# EAGLE design ball_catch_order (EAGLE 9.6.2)
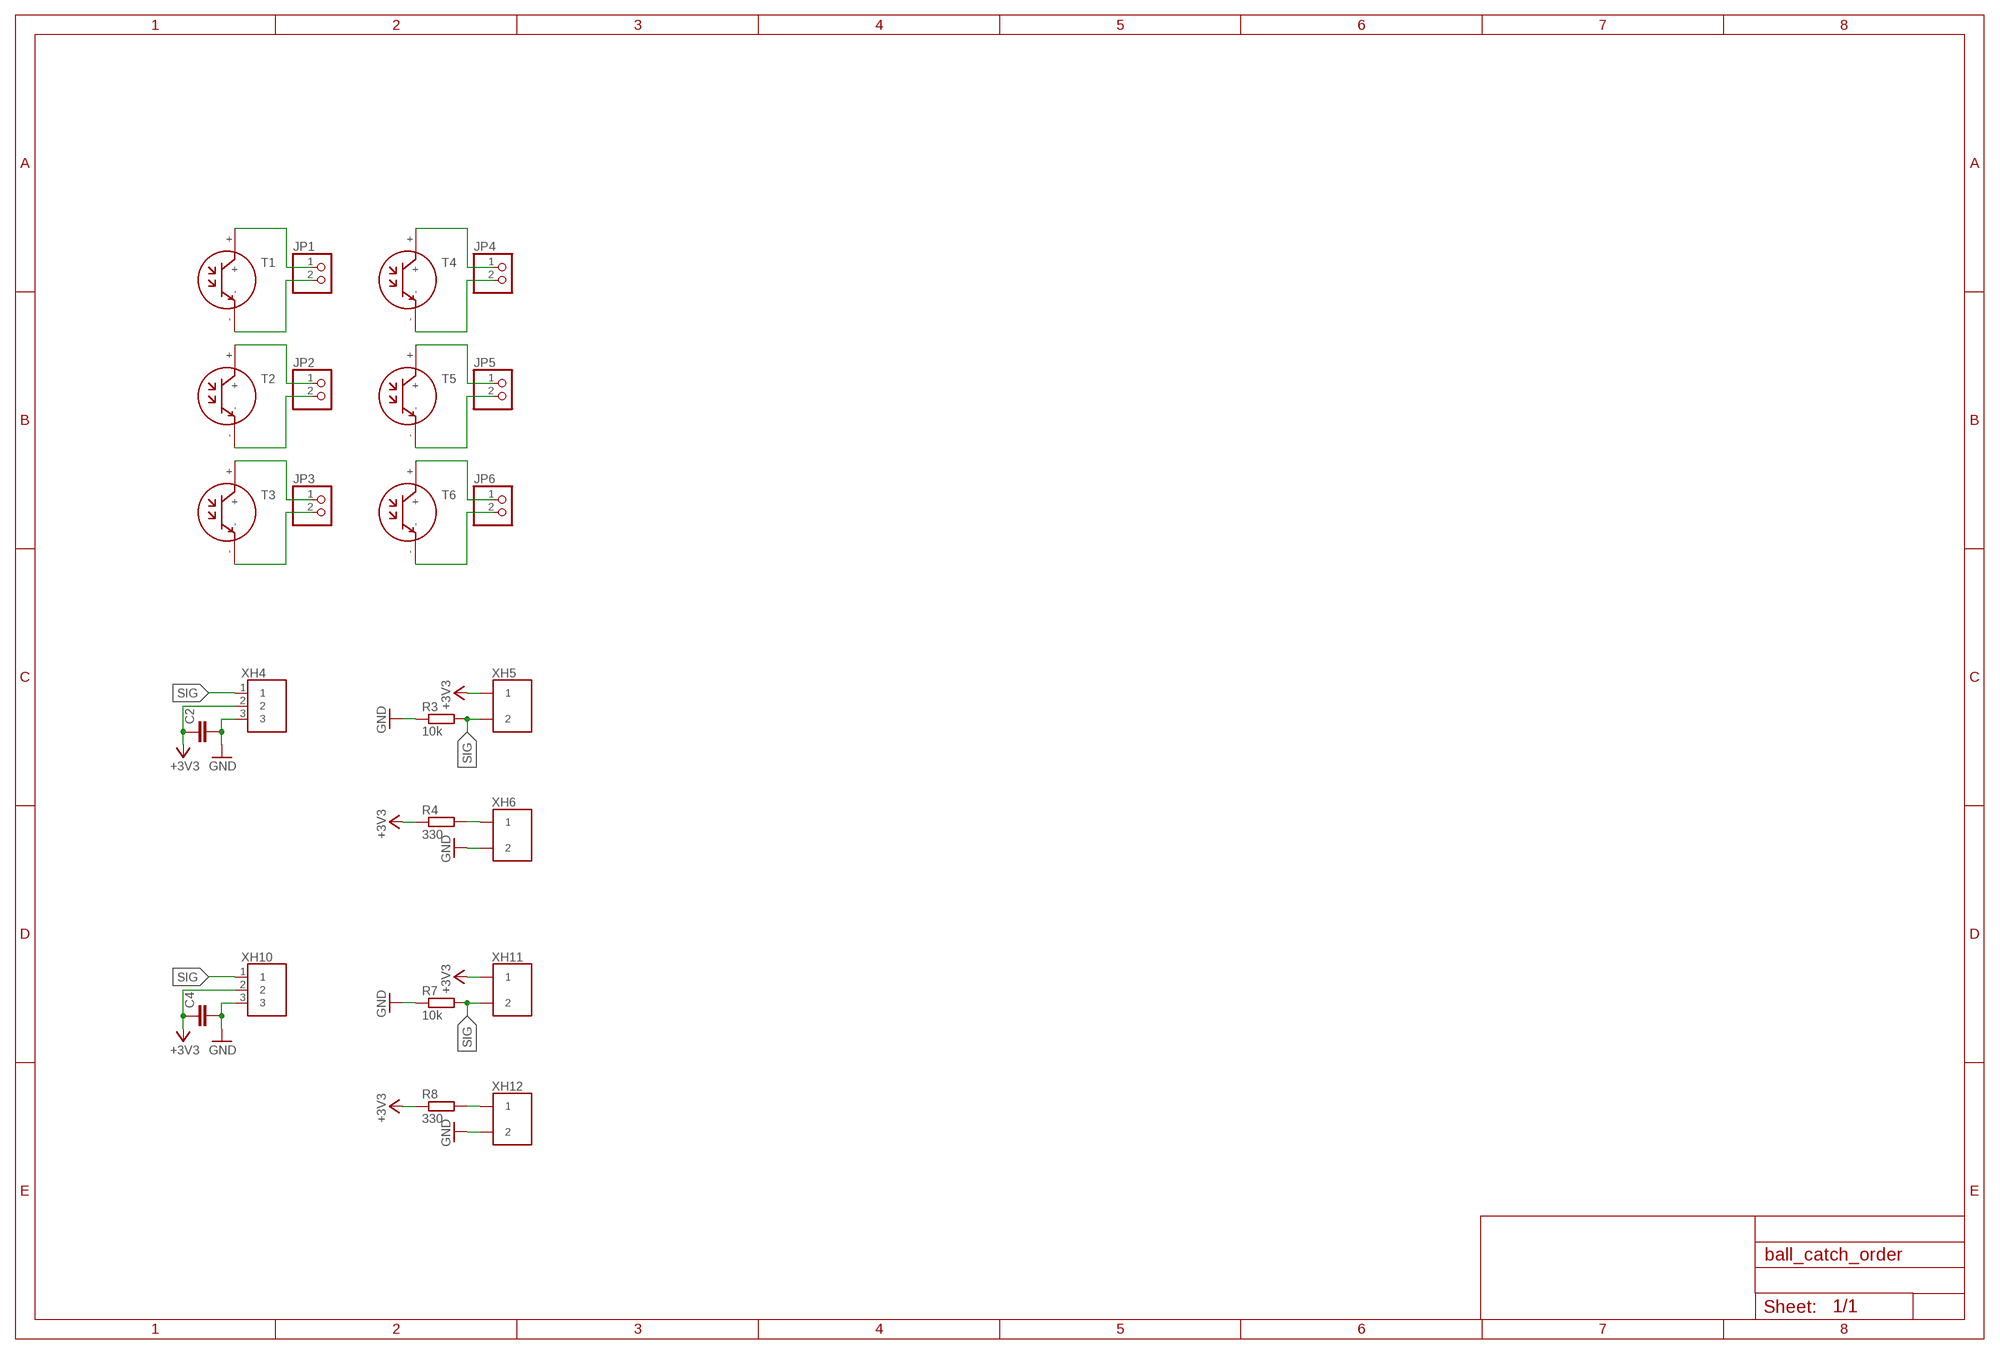
[diagram p0: schematic, sheet 1]

## Parts
C2  C-EUC0603  [C0603]
C4  C-EUC0603  [C0603]
JP1  PINHD-1X2  [1X02]
JP2  PINHD-1X2  [1X02]
JP3  PINHD-1X2  [1X02]
JP4  PINHD-1X2  [1X02]
JP5  PINHD-1X2  [1X02]
JP6  PINHD-1X2  [1X02]
R3  10k  R-EU_0204/7  [0204/7]
R4  330  R-EU_0204/7  [0204/7]
R7  10k  R-EU_0204/7  [0204/7]
R8  330  R-EU_0204/7  [0204/7]
T1  NJL7302L-F3  [NJL7302L-F3]
T2  NJL7302L-F3  [NJL7302L-F3]
T3  NJL7302L-F3  [NJL7302L-F3]
T4  NJL7302L-F3  [NJL7302L-F3]
T5  NJL7302L-F3  [NJL7302L-F3]
T6  NJL7302L-F3  [NJL7302L-F3]
XH4  S3B  [S3B]
XH5  2B  [2B]
XH6  S2B  [S2B]
XH10  S3B  [S3B]
XH11  2B  [2B]
XH12  S2B  [S2B]

## Nets
+3V3: C2.1 C4.1 R4.1 R8.1 XH4.2 XH5.1 XH10.2 XH11.1
GND: C2.2 C4.2 R3.1 R7.1 XH4.3 XH6.2 XH10.3 XH12.2
N$1: JP1.1 T1.+
N$2: JP1.2 T1.-
N$3: JP2.1 T2.+
N$4: JP2.2 T2.-
N$5: JP3.1 T3.+
N$6: JP3.2 T3.-
N$7: JP4.1 T4.+
N$8: JP4.2 T4.-
N$9: JP5.1 T5.+
N$10: JP5.2 T5.-
N$11: JP6.1 T6.+
N$12: JP6.2 T6.-
N$14: R4.2 XH6.1
N$16: R8.2 XH12.1
SIG: R3.2 R7.2 XH4.1 XH5.2 XH10.1 XH11.2

## Library data of the parts
C2 C4 = rcl:C-EU: CAPACITOR, European symbol; SPICEPREFIX: C
JP1-JP6 = pinhead:PINHD-1X2: PIN HEADER
R3 R4 R7 R8 = rcl:R-EU_: RESISTOR, European symbol; SPICEPREFIX: R
T1-T6 = NJL7302L-F3:NJL7302L-F3
XH4 XH10 = XH:S3B
XH5 XH11 = XH:2B
XH6 XH12 = XH:S2B

## Board
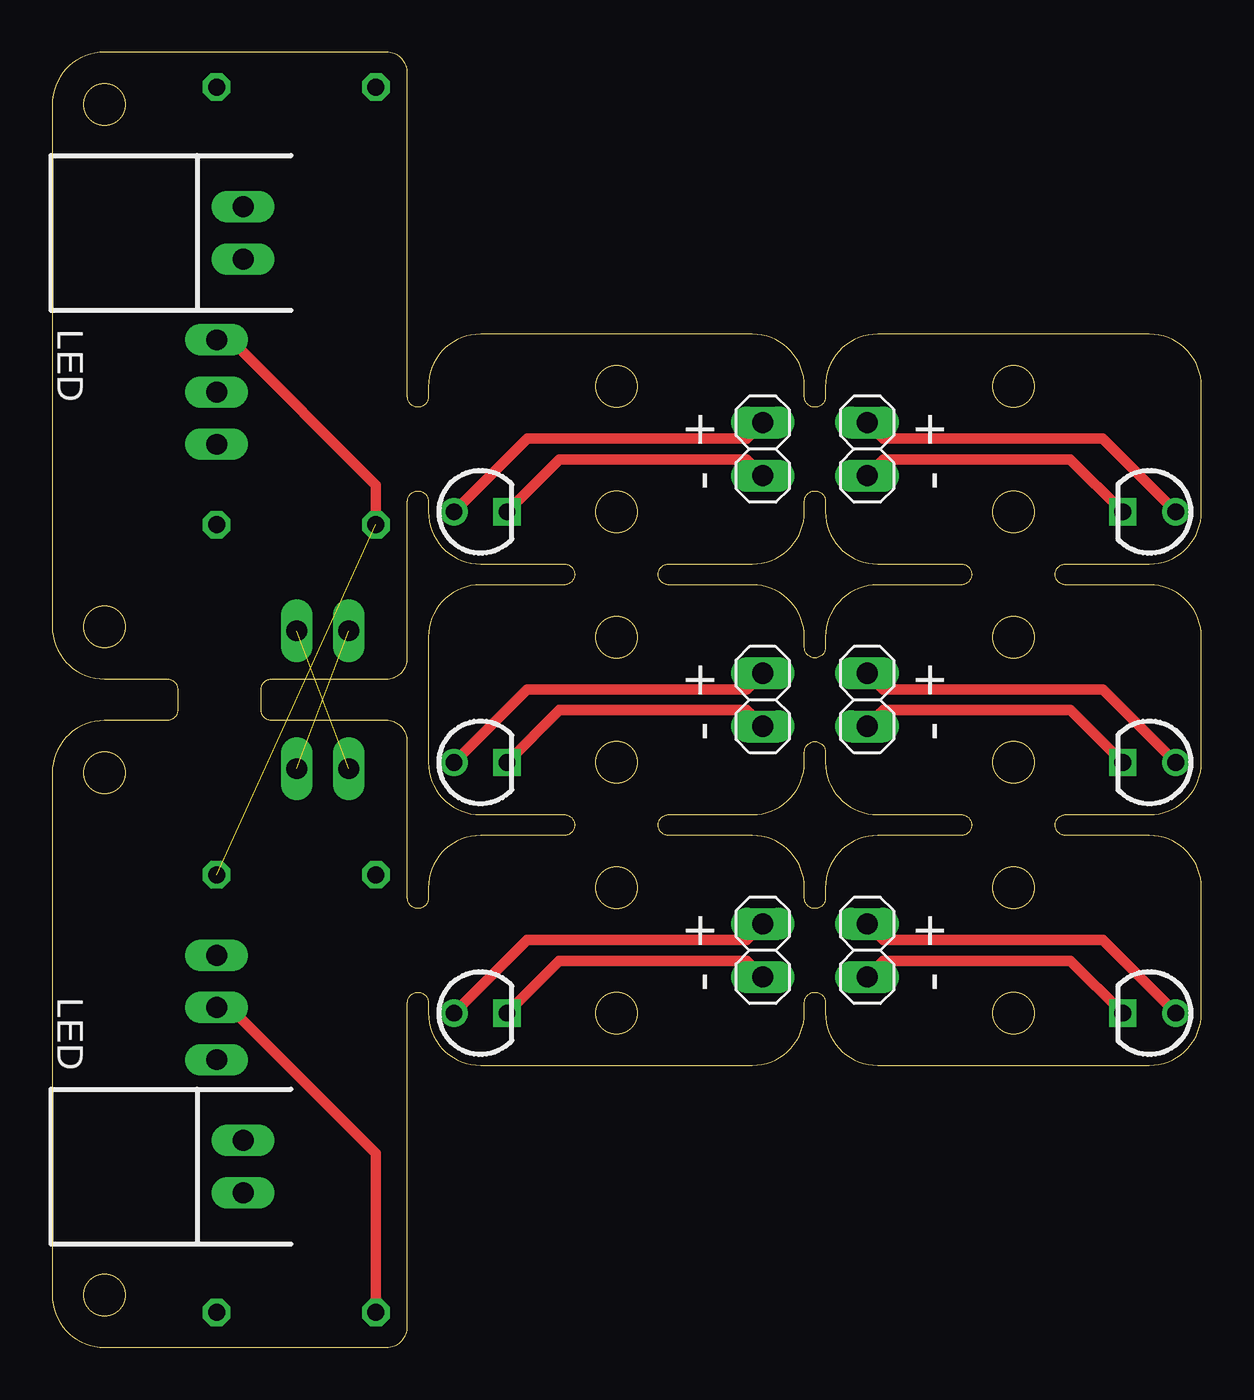
[diagram p1: board, top side]
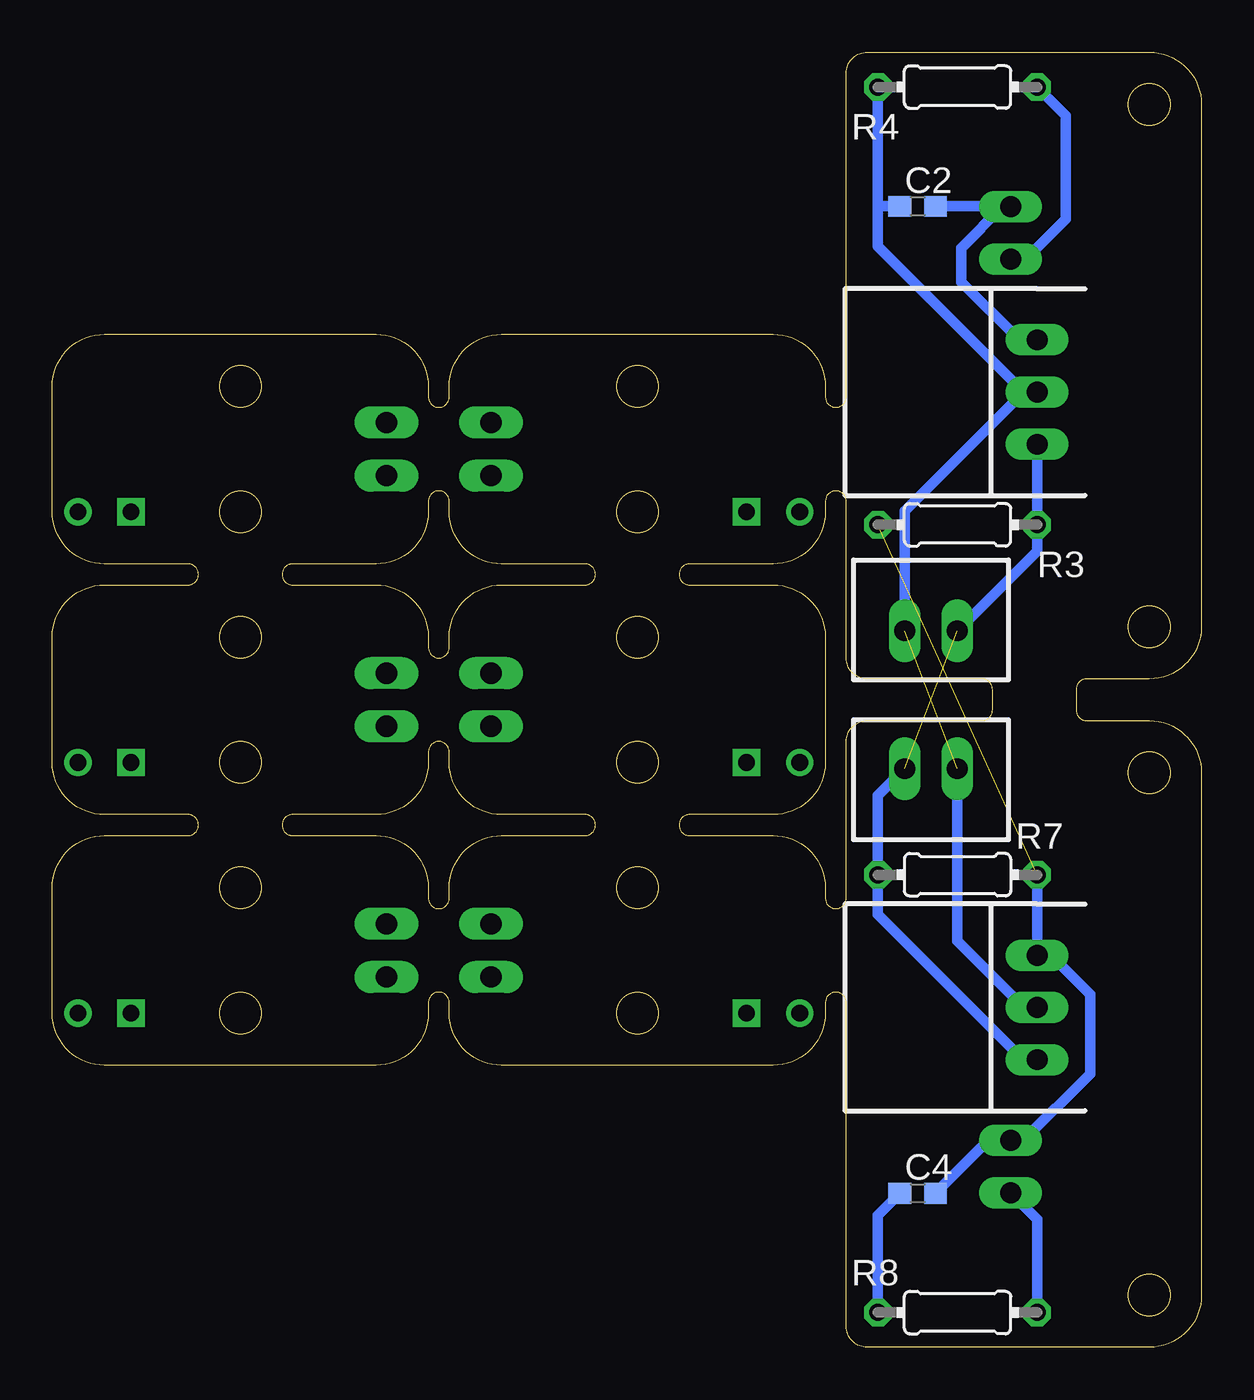
[diagram p2: board, bottom side, seen from below]

Size 55 x 62 mm. Coordinates in mm from the lower left corner, seen from the top.
Outline: 16,32 arc90 17,33 17,40.5 arc-90 17.5,41 arc-90 18,40.5 18,40 arc90 20.5,37.5 24.5,37.5 arc-180 24.5,36.5 20.5,36.5 arc90 18,34 18,28 arc90 20.5,25.5 24.5,25.5 arc-180 24.5,24.5 20.5,24.5 arc90 18,22 18,21.5 arc-90 17.5,21 arc-90 17,21.5 17,29 arc90 16,30 10.5,30 arc-90 10,30.5 10,31.5 arc-90 10.5,32 16,32
Outline: 17,61 arc90 16,62 2.5,62 arc90 0,59.5 0,34.5 arc90 2.5,32 5.5,32 arc-90 6,31.5 6,30.5 arc-90 5.5,30 2.5,30 arc90 0,27.5 0,2.5 arc90 2.5,0 16,0 arc90 17,1 17,16.5 arc-90 17.5,17 arc-90 18,16.5 18,16 arc90 20.5,13.5 33.5,13.5 arc90 36,16 36,16.5 arc-180 37,16.5 37,16 arc90 39.5,13.5 52.5,13.5 arc90 55,16 55,22 arc90 52.5,24.5 48.5,24.5 arc-180 48.5,25.5 52.5,25.5 arc90 55,28 55,34 arc90 52.5,36.5 48.5,36.5 arc-180 48.5,37.5 52.5,37.5 arc90 55,40 55,46 arc90 52.5,48.5 39.5,48.5 arc90 37,46 37,45.5 arc-180 36,45.5 36,46 arc90 33.5,48.5 20.5,48.5 arc90 18,46 18,45.5 arc-90 17.5,45 arc-90 17,45.5 17,61
Outline: 37,28.5 37,28 arc90 39.5,25.5 43.5,25.5 arc-180 43.5,24.5 39.5,24.5 arc90 37,22 37,21.5 arc-180 36,21.5 36,22 arc90 33.5,24.5 29.5,24.5 arc-180 29.5,25.5 33.5,25.5 arc90 36,28 36,28.5 arc-180 37,28.5
Outline: 37,40.5 37,40 arc90 39.5,37.5 43.5,37.5 arc-180 43.5,36.5 39.5,36.5 arc90 37,34 37,33.5 arc-180 36,33.5 36,34 arc90 33.5,36.5 29.5,36.5 arc-180 29.5,37.5 33.5,37.5 arc90 36,40 36,40.5 arc-180 37,40.5
Outline: circle at 2.5,27.5 radius 1
Outline: circle at 2.5,2.5 radius 1
Outline: circle at 2.5,34.5 radius 1
Outline: circle at 2.5,59.5 radius 1
Outline: circle at 46,16 radius 1
Outline: circle at 46,22 radius 1
Outline: circle at 46,46 radius 1
Outline: circle at 46,40 radius 1
Outline: circle at 46,28 radius 1
Outline: circle at 46,34 radius 1
Outline: circle at 27,34 radius 1
Outline: circle at 27,28 radius 1
Outline: circle at 27,40 radius 1
Outline: circle at 27,46 radius 1
Outline: circle at 27,22 radius 1
Outline: circle at 27,16 radius 1
Copper layers (1*16): Top 0.035mm / dielectric 1.5mm / Bottom 0.035mm
Design rules "default *": minimum track width 6mil, minimum drill 0.35mm, track to track 6mil, track to pad 6mil, pad to pad 6mil, via to via 6mil, smd to smd 6mil, copper to edge 30mil, drill to drill 6mil, minimum pad ring 10mil, minimum via ring 8mil, stop-mask expansion 4mil, vias tented up to drill 0mil, thermal gap 10mil

### Footprints (pad centres in the part's own frame; a part is rotated, then mirrored left to right if it is on the bottom)
C0603 = smd 1.1 x 1: 1 -0.85,0; 2 0.85,0
1X02 = drill 1.016 long: 1 -1.27,0; 2 1.27,0
0204/7 = drill 0.813 octagon: 1 -3.81,0; 2 3.81,0
NJL7302L-F3 = drill 0.8: + 1.27,0 | drill 0.8 square: - -1.27,0
S3B = drill 1 long: 1 0,2.5; 2 0,0; 3 0,-2.5
2B = drill 1 long: 1 0,1.25; 2 0,-1.25
S2B = drill 1 long: 1 0,1.25; 2 0,-1.25

### Placement (x,y rotation side)
C2  13.58,54.62 0 bottom
C4  13.58,7.38 0 bottom
JP1  34,43 270 top
JP2  34,31 270 top
JP3  34,19 270 top
JP4  39,43 270 top
JP5  39,31 270 top
JP6  39,19 270 top
R3  11.68,39.38 0 bottom
R4  11.68,60.34 0 bottom
R7  11.68,22.62 180 bottom
R8  11.68,1.66 0 bottom
T1  20.5,40 180 top
T2  20.5,28 180 top
T3  20.5,16 180 top
T4  52.5,40 0 top
T5  52.5,28 0 top
T6  52.5,16 0 top
XH4  7.86,45.73 180 bottom
XH5  12.95,34.3 90 bottom
XH6  9.14,53.35 180 top
XH10  7.86,16.27 180 bottom
XH11  12.95,27.7 270 bottom
XH12  9.14,8.65 180 top

### Tracks (layer width: path | path; a pad name or v marks a point on that pad's centre or on a via)
+3V3  (1 unrouted)
  Top 0.5: R8.1 15.48,9.29 8.5,16.27 XH10.2
  Bottom 0.5: XH4.2 8.5,45.73 | 8.5,45.73 14.2,40.03 XH5.1 | 8.5,45.73 15.48,52.72 15.48,54.62 | R4.1 15.48,54.62 | C2.1 15.48,54.62 | R8.1 15.48,6.32 C4.1 | XH11.1 11.7,19.46 8.5,16.27 XH10.2
GND  (1 unrouted)
  Top 0.5: XH4.3 8.54,48.23 15.48,41.28 R3.1
  Bottom 0.5: XH6.2 9.16,54.62 9.5,54.62 | 9.5,54.62 C2.2 | XH4.3 8.73,48.23 11.5,51 11.5,52.62 9.5,54.62 | C4.2 10.21,9.9 XH12.2 8.52,9.9 5.32,13.09 5.32,16.91 7.23,18.81 7.82,18.81 XH10.3 R7.1
N$1
  Top 0.5: T1.+ 22.73,43.5 33.23,43.5 JP1.1
N$2
  Top 0.5: T1.- 24.27,42.5 33.23,42.5 JP1.2
N$3
  Top 0.5: T2.+ 22.73,31.5 33.23,31.5 JP2.1
N$4
  Top 0.5: T2.- 24.27,30.5 33.23,30.5 JP2.2
N$5
  Top 0.5: T3.+ 22.73,19.5 33.23,19.5 JP3.1
N$6
  Top 0.5: T3.- 24.27,18.5 33.23,18.5 JP3.2
N$7
  Top 0.5: T4.+ 50.27,43.5 39.77,43.5 JP4.1
N$8
  Top 0.5: T4.- 48.73,42.5 39.77,42.5 JP4.2
N$9
  Top 0.5: T5.+ 50.27,31.5 39.77,31.5 JP5.1
N$10
  Top 0.5: T5.- 48.73,30.5 39.77,30.5 JP5.2
N$11
  Top 0.5: T6.+ 50.27,19.5 39.77,19.5 JP6.1
N$12
  Top 0.5: T6.- 48.73,18.5 39.77,18.5 JP6.2
N$14
  Bottom 0.5: R4.2 6.5,58.97 6.5,54 8.5,52 9.04,52 XH6.1
N$16
  Bottom 0.5: XH12.1 7.86,6.13 R8.2
SIG  (1 unrouted)
  Bottom 0.5: XH4.1 R3.2 7.86,38.13 XH5.2 | XH11.2 15.48,26.41 R7.2 15.48,20.71 8.5,13.73 7.91,13.73 XH10.1

### Text on the board
tPlace: LED | + | + | - | - | + | + | - | - | + | + | - | - | LED